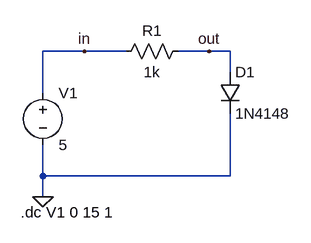
[diagram p0: schematic exercise2.asc]
exercise2.asc, the LTspice schematic file:
Version 4
SHEET 1 880 680
WIRE 208 80 144 80
WIRE 272 80 208 80
WIRE 400 80 352 80
WIRE 432 80 400 80
WIRE 432 112 432 80
WIRE 144 144 144 80
WIRE 144 272 144 224
WIRE 432 272 432 176
WIRE 432 272 144 272
WIRE 144 304 144 272
FLAG 144 304 0
FLAG 208 80 in
FLAG 400 80 out
SYMBOL voltage 144 128 R0
SYMATTR InstName V1
SYMATTR Value 5
SYMBOL res 256 96 R270
WINDOW 0 32 56 VTop 2
WINDOW 3 0 56 VBottom 2
SYMATTR InstName R1
SYMATTR Value 1k
SYMBOL diode 416 112 R0
SYMATTR InstName D1
SYMATTR Value 1N4148
TEXT 110 328 Left 2 !.dc V1 0 15 1

The netlist it stands for:
* exercise2.asc
V1 in 0 5
R1 in out 1k
D1 out 0 1N4148
.model D D
.lib standard.dio
.dc V1 0 15 1
.backanno
.end